# EAGLE design board (EAGLE 7.5.0)
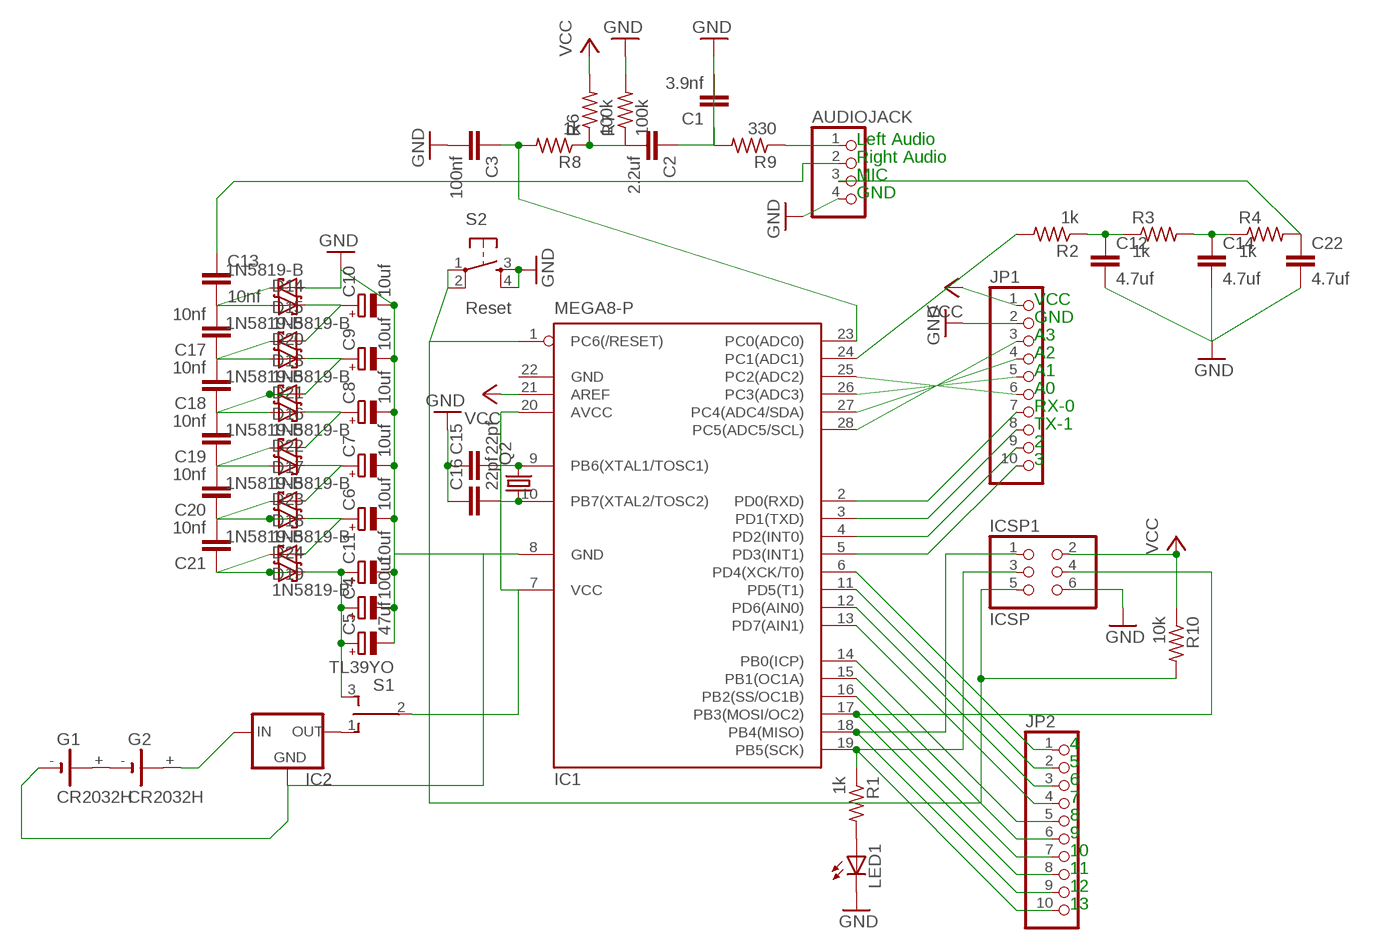
[diagram p0: schematic, sheet 1]

## Parts
AUDIOJACK  PINHD-1X4  [1X04]
C1  3.9nf  C-EU050-024X044  [C050-024X044]
C2  2.2uf  C-EU050-024X044  [C050-024X044]
C3  100nf  C-EU050-024X044  [C050-024X044]
C4  100uf  CPOL-EUE2,5-6E  [E2,5-6E]
C5  47uf  CPOL-EUE2-5  [E2-5]
C6  10uf  CPOL-EUB45181B  [B45181B]
C7  10uf  CPOL-EUB45181B  [B45181B]
C8  10uf  CPOL-EUB45181B  [B45181B]
C9  10uf  CPOL-EUB45181B  [B45181B]
C10  10uf  CPOL-EUB45181B  [B45181B]
C11  10uf  CPOL-EUB45181B  [B45181B]
C12  4.7uf  C-EU050-024X044  [C050-024X044]
C13  10nf  C-EU050-024X044  [C050-024X044]
C14  4.7uf  C-EU050-024X044  [C050-024X044]
C15  22pf  C-EU025-025X050  [C025-025X050]
C16  22pf  C-EU025-025X050  [C025-025X050]
C17  10nf  C-EU050-024X044  [C050-024X044]
C18  10nf  C-EU050-024X044  [C050-024X044]
C19  10nf  C-EU050-024X044  [C050-024X044]
C20  10nf  C-EU050-024X044  [C050-024X044]
C21  10nf  C-EU050-024X044  [C050-024X044]
C22  4.7uf  C-EU050-024X044  [C050-024X044]
D13  1N5819-B  [DO41-7.6]
D14  1N5819-B  [DO41-7.6]
D15  1N5819-B  [DO41-7.6]
D16  1N5819-B  [DO41-7.6]
D17  1N5819-B  [DO41-7.6]
D18  1N5819-B  [DO41-7.6]
D19  1N5819-B  [DO41-7.6]
D20  1N5819-B  [DO41-7.6]
D21  1N5819-B  [DO41-7.6]
D22  1N5819-B  [DO41-7.6]
D23  1N5819-B  [DO41-7.6]
D24  1N5819-B  [DO41-7.6]
G1  CR2032H  [CR2032H]
G2  CR2032H  [CR2032H]
IC1  MEGA8-P  [DIL28-3]
IC2  XC63FPL  [TO92]
ICSP1  ICSP  PINHD-2X3  [2X03]
JP1  PINHD-1X10  [1X10]
JP2  PINHD-1X10  [1X10]
LED1  LED3MM  [LED3MM]
Q2  CRYSTALHC18U-V  [HC18U-V]
R1  1k  R-US_0207/10  [0207/10]
R2  1k  R-US_0207/10  [0207/10]
R3  1k  R-US_0207/10  [0207/10]
R4  1k  R-US_0207/10  [0207/10]
R6  100k  R-US_0207/10  [0207/10]
R7  100k  R-US_0207/10  [0207/10]
R8  1k  R-US_0207/10  [0207/10]
R9  330  R-US_0207/10  [0207/10]
R10  10k  R-US_0207/10  [0207/10]
S1  TL39YO  [TL3XYO]
S2  Reset  TAC_SWITCHPTH  [TACTILE-PTH]

## Nets
GND: AUDIOJACK.4 C1.2 C3.2 C4.- C5.- C6.- C7.- C8.- C9.- C10.- C11.- C12.2 C14.2 C15.1 C16.1 C22.2 D15.A G1.- IC1.8(GND) IC2.2(GND) ICSP1.6 JP1.2 LED1.K(C) R7.2 R9.2 S2.3 S2.4
N$1: IC1.18(PB4(MISO)) ICSP1.1 JP2.9
N$2: AUDIOJACK.2 C13.1
N$3: AUDIOJACK.1 R9.1
N$4: IC1.24(PC1(ADC1)) R2.2
N$5: IC1.19(PB5(SCK)) ICSP1.3 JP2.10 R1.1
N$6: IC1.1(PC6(/RESET)) ICSP1.5 R10.2 S2.1 S2.2
N$7: C15.2 IC1.9(PB6(XTAL1/TOSC1)) Q2.2
N$8: C16.2 IC1.10(PB7(XTAL2/TOSC2)) Q2.1
N$9: IC2.3(OUT) S1.1(O)
N$10: G1.+ G2.-
N$11: G2.+ IC2.1(IN)
N$12: IC1.7(VCC) IC1.20(AVCC) S1.2(P)
N$13: C3.1 IC1.23(PC0(ADC0)) R8.2
N$14: LED1.A R1.2
N$15: C1.1 C2.1
N$16: IC1.28(PC5(ADC5/SCL)) JP1.3
N$17: C12.1 R2.1 R3.1
N$18: C14.1 R3.2 R4.1
N$19: IC1.27(PC4(ADC4/SDA)) JP1.4
N$20: AUDIOJACK.3 C22.1 R4.2
N$21: IC1.26(PC3(ADC3)) JP1.5
N$22: IC1.17(PB3(MOSI/OC2)) ICSP1.4 JP2.8
N$23: IC1.25(PC2(ADC2)) JP1.6
N$24: C2.2 R6.1 R7.1 R8.1
N$25: IC1.2(PD0(RXD)) JP1.7
N$26: IC1.3(PD1(TXD)) JP1.8
N$27: IC1.4(PD2(INT0)) JP1.9
N$28: IC1.5(PD3(INT1)) JP1.10
N$29: IC1.6(PD4(XCK/T0)) JP2.1
N$30: IC1.11(PD5(T1)) JP2.2
N$31: IC1.12(PD6(AIN0)) JP2.3
N$32: IC1.13(PD7(AIN1)) JP2.4
N$33: IC1.14(PB0(ICP)) JP2.5
N$34: IC1.15(PB1(OC1A)) JP2.6
N$35: IC1.16(PB2(SS/OC1B)) JP2.7
N$36: C13.2 C17.2 D14.A D15.C
N$37: C17.1 C18.2 D13.C D20.A
N$38: C18.1 C19.2 D16.C D21.A
N$39: C19.1 C20.2 D17.C D22.A
N$40: C20.1 C21.2 D18.C D23.A
N$41: C21.1 D19.C D24.A
N$42: C10.+ D13.A D14.C
N$43: C9.+ D16.A D20.C
N$44: C8.+ D17.A D21.C
N$45: C7.+ D18.A D22.C
N$46: C6.+ D19.A D23.C
N$47: C4.+ C5.+ C11.+ D24.C S1.3(S)
VCC: IC1.21(AREF) ICSP1.2 JP1.1 R6.2 R10.1
Unconnected: G1.+@1(+) G2.+@1(+)

## Notes on the sheet
- Left Audio
- Right Audio
- MIC
- GND
- VCC
- GND
- A3
- A2
- A1
- A0
- RX-0
- TX-1
- 2
- 3
- 4
- 5
- 6
- 7
- 8
- 9
- 10
- 11
- 12
- 13

## Power pins joined to a net without a drawn wire
GND: IC1.22(GND)

## Library data of the parts
AUDIOJACK = pinhead:PINHD-1X4: PIN HEADER
C1-C3 C12-C22 = resistor:C-EU: CAPACITOR, European symbol
C4-C11 = resistor:CPOL-EU: POLARIZED CAPACITOR, European symbol
D13-D24 = diode:1N581*: 1.0A SCHOTTKY BARRIER RECTIFIER Source: http://www.diodes.com/datasheets/ds23001.pdf
G1 G2 = battery:CR2032H: LI BATTERY Varta
IC1 = atmel:MEGA8-P: MICROCONTROLLER 8 Kbytes FLASH, 1 kbytes SRAM, 512 bytes EEPROM, USART, 4-channel 10 bit ADC, 2-channel 8 bit ADC Pin compatible with Atmega48, ATMega88, ATMega168 Source: avr.lbr; OC_FARNELL: unknown; OC_NEWARK: unknown
IC2 = v-reg:XC63FP: Positiv Voltage Regulators www.torex.co.jp/english/product/pro02/pdf/0201_xc62fp.pdf
ICSP1 = pinhead:PINHD-2X3: PIN HEADER
JP1 JP2 = pinhead:PINHD-1X10: PIN HEADER
LED1 = led:LED: LED OSRAM: - CHIPLED LG R971, LG N971, LY N971, LG Q971, LY Q971, LO R971, LY R971 LH N974, LH R974 LS Q976, LO Q976, LY Q976 LO Q996 - Hyper CHIPLED LW Q18S LB Q993, LB Q99A, LB R99A - SideLED LS A670, LO A670, LY A670, LG A670, LP A670 LB A673, LV A673, LT A673, LW A673 LH A674 LY A675 LS A676, LA A676, LO A676, LY A676, LW A676 LS A679, LY A679, LG A679 - Hyper Micro SIDELED® LS Y876, LA Y876, LO Y876, LY Y876 LT Y87S - SmartLED LW L88C, LW L88S LB L89C, LB L89S, LG L890 LS L89K, LO L89K, LY L89K LS L896, LA L896, LO L896, LY L896 - TOPLED LS T670, LO T670, LY T670, LG T670, LP T670 LSG T670, LSP T670, LSY T670, LOP T670, LYG T670 LG T671, LOG T671, LSG T671 LB T673, LV T673, LT T673, LW T673 LH T674 LS T676, LA T676, LO T676, LY T676, LB T676, LH T676, LSB T676, LW T676 LB T67C, LV T67C, LT T67C, LS T67K, LO T67K, LY T67K, LW E67C LS E67B, LA E67B, LO E67B, LY E67B, LB E67C, LV E67C, LT E67C LW T67C LS T679, LY T679, LG T679 LS T770, LO T770, LY T770, LG T770, LP T770 LB T773, LV T773, LT T773, LW T773 LH T774 LS E675, LA E675, LY E675, LS T675 LS T776, LA T776, LO T776, LY T776, LB T776 LHGB T686 LT T68C, LB T68C - Hyper Mini TOPLED® LB M676 - Mini TOPLED Santana® LG M470 LS M47K, LO M47K, LY M47K Source: http://www.osram.convergy.de LUXEON: - LUMILED® LXK2-PW12-R00, LXK2-PW12-S00, LXK2-PW14-U00, LXK2-PW14-V00 LXK2-PM12-R00, LXK2-PM12-S00, LXK2-PM14-U00 LXK2-PE12-Q00, LXK2-PE12-R00, LXK2-PE12-S00, LXK2-PE14-T00, LXK2-PE14-U00 LXK2-PB12-K00, LXK2-PB12-L00, LXK2-PB12-M00, LXK2-PB14-N00, LXK2-PB14-P00, LXK2-PB14-Q00 LXK2-PR12-L00, LXK2-PR12-M00, LXK2-PR14-Q00, LXK2-PR14-R00 LXK2-PD12-Q00, LXK2-PD12-R00, LXK2-PD12-S00 LXK2-PH12-R00, LXK2-PH12-S00 LXK2-PL12-P00, LXK2-PL12-Q00, LXK2-PL12-R00 Source: www.luxeon.com KINGBRIGHT: KA-3528ASYC Source: www.kingbright.com
Q2 = crystal:CRYSTAL: CRYSTAL; OC_FARNELL: unknown; OC_NEWARK: unknown
R1-R4 R6-R10 = resistor:R-US_: RESISTOR, American symbol
S1 = switch:TL39YO: TINY SWITCH ON OFF ON Source: http://www2.produktinfo.conrad.com/datenblaetter/700000-724999/705152-da-01-de-Subminiaturschalter_TL_36YO.pdf
S2 = SparkFun-Retired:TAC_SWITCH: Momentary Switch Button commonly used for reset or general input. Spark Fun Electronics SKU : COM-00097 SMT- SWCH-08247

## Board
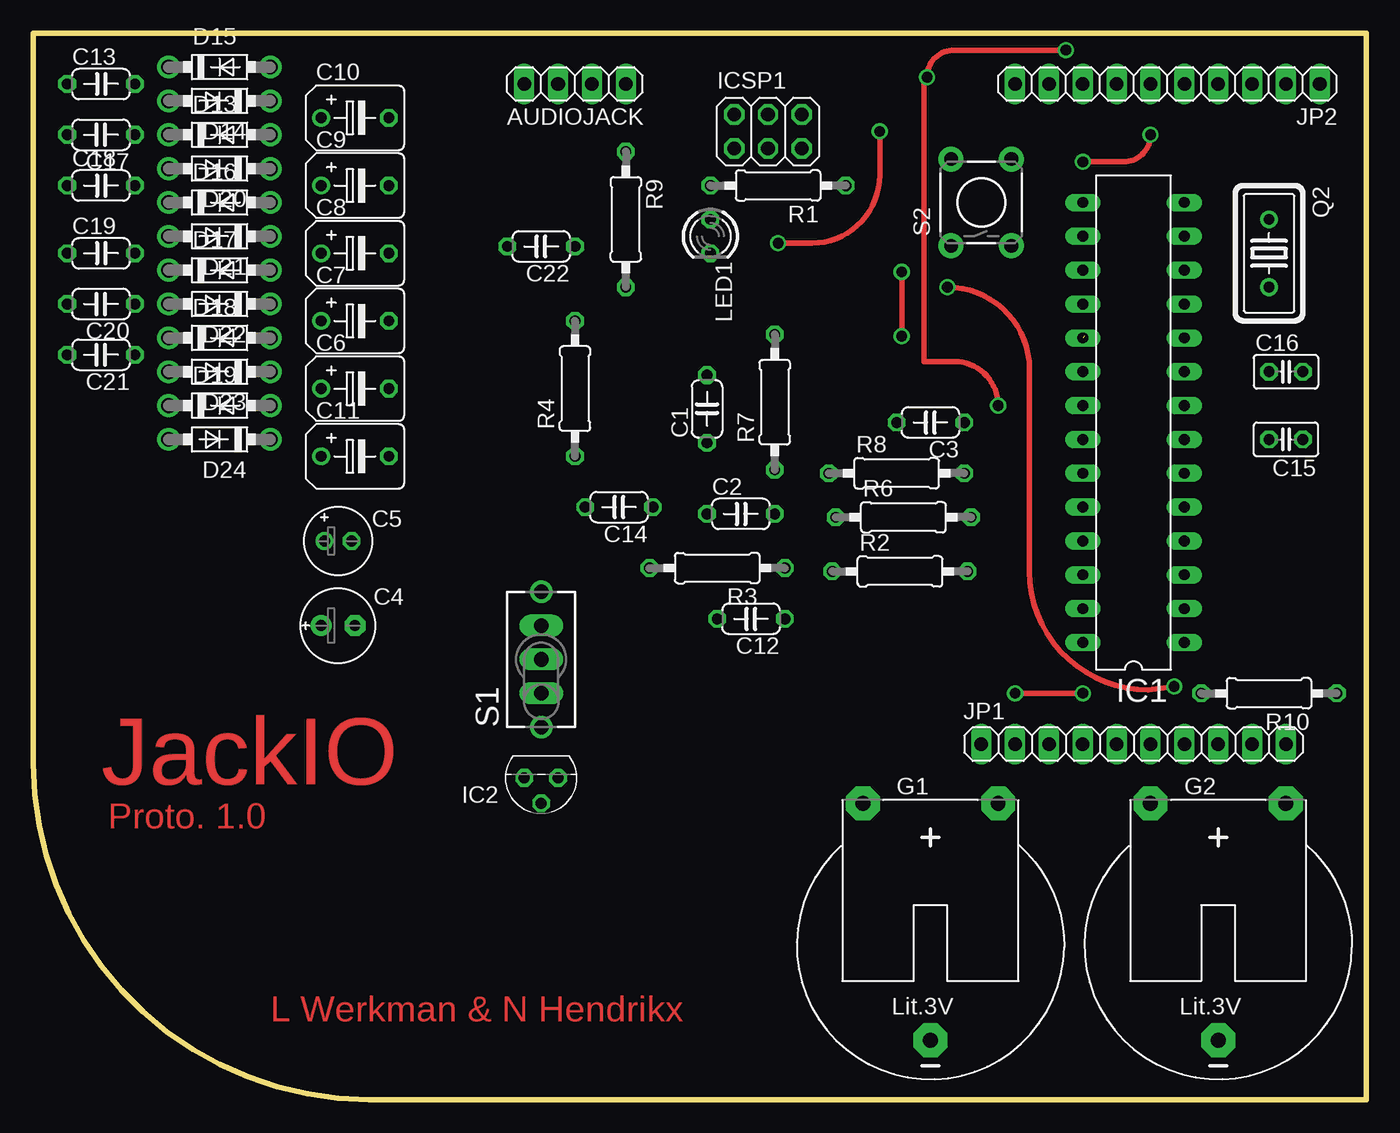
[diagram p1: board, top side]
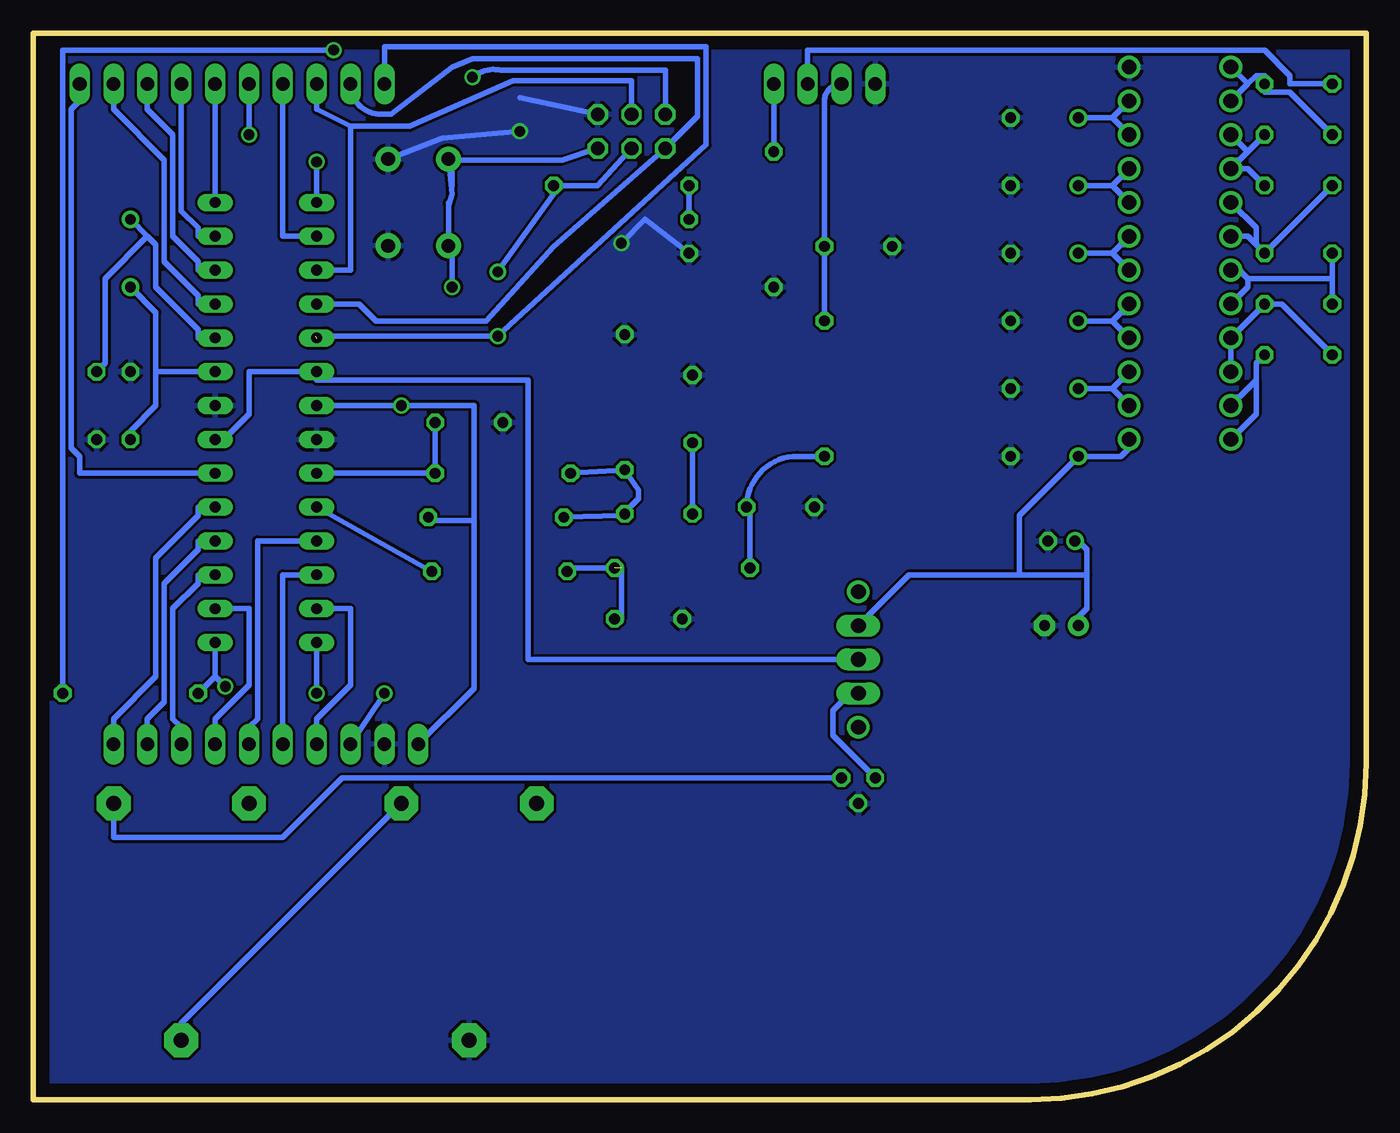
[diagram p2: board, bottom side, seen from below]

Size 100 x 80 mm. Coordinates in mm from the lower left corner, seen from the top.
Outline: 0,80 0,25.21 arc90 25.21,0 100,0 100,80 0,80
Copper layers (1*16): Top 0.035mm / dielectric 1.5mm / Bottom 0.035mm
Design rules "default": minimum track width 10mil, minimum drill 24mil, track to track 8mil, track to pad 8mil, pad to pad 8mil, via to via 8mil, smd to smd 8mil, copper to edge 40mil, drill to drill 8mil, minimum pad ring 10mil, minimum via ring 8mil, stop-mask expansion 4mil, vias tented up to drill 0mil, thermal gap 10mil

### Footprints (pad centres in the part's own frame; a part is rotated, then mirrored left to right if it is on the bottom)
1X04 = drill 1.016 long: 1 -3.81,0; 2 -1.27,0; 3 1.27,0; 4 3.81,0
C050-024X044 = drill 0.813 octagon: 1 -2.54,0; 2 2.54,0
E2,5-6E = drill 0.813 pad 1.575: + -1.27,0 | drill 0.813 pad 1.575 octagon: - 1.27,0
E2-5 = drill 0.813 pad 1.27: + -1.016,0 | drill 0.813 pad 1.27 octagon: - 1.016,0
B45181B = drill 0.813: + -2.54,0 | drill 0.813 octagon: - 2.54,0
C025-025X050 = drill 0.813 octagon: 1 -1.27,0; 2 1.27,0
DO41-7.6 = drill 1.1 pad 1.7: A 3.81,0; C -3.81,0
CR2032H = drill 1.118 pad 2.54 octagon: + 5.08,10.795; +@1 -5.08,10.795; - 0,-6.985
DIL28-3 = drill 0.813 long: 1 -16.51,-3.81; 2 -13.97,-3.81; 3 -11.43,-3.81; 4 -8.89,-3.81; 5 -6.35,-3.81; 6 -3.81,-3.81; 7 -1.27,-3.81; 8 1.27,-3.81; 9 3.81,-3.81; 10 6.35,-3.81; 11 8.89,-3.81; 12 11.43,-3.81; 13 13.97,-3.81; 14 16.51,-3.81; 15 16.51,3.81; 16 13.97,3.81; 17 11.43,3.81; 18 8.89,3.81; 19 6.35,3.81; 20 3.81,3.81; 21 1.27,3.81; 22 -1.27,3.81; 23 -3.81,3.81; 24 -6.35,3.81; 25 -8.89,3.81; 26 -11.43,3.81; 27 -13.97,3.81; 28 -16.51,3.81
TO92 = drill 0.813 octagon: 1 -1.27,0; 2 0,1.905; 3 1.27,0
2X03 = drill 1.016 octagon: 1 -2.54,-1.27; 2 -2.54,1.27; 3 0,-1.27; 4 0,1.27; 5 2.54,-1.27; 6 2.54,1.27
1X10 = drill 1.016 long: 1 -11.43,0; 2 -8.89,0; 3 -6.35,0; 4 -3.81,0; 5 -1.27,0; 6 1.27,0; 7 3.81,0; 8 6.35,0; 9 8.89,0; 10 11.43,0
LED3MM = drill 0.813 octagon: A -1.27,0; K 1.27,0
HC18U-V = drill 0.813: 1 -2.54,0; 2 2.54,0
0207/10 = drill 0.813 octagon: 1 -5.08,0; 2 5.08,0
TL3XYO = drill 1.1 pad 1.422 long: 1 -2.54,0; 2 0,0; 3 2.54,0 | drill 1.1 pad 1.676: M1 -5.08,0; M2 5.08,0
TACTILE-PTH = drill 1.016 pad 1.88: 1 -3.251,2.261; 2 3.251,2.261; 3 -3.251,-2.261; 4 3.251,-2.261

### Placement (x,y rotation side)
AUDIOJACK  40.64,76.2 180 top
C1  50.55,51.82 90 top
C2  53.09,43.94 0 top
C3  67.31,50.8 180 top
C4  22.86,35.56 0 top
C5  22.86,41.91 0 top
C6  24.13,53.34 0 top
C7  24.13,58.42 0 top
C8  24.13,63.5 0 top
C9  24.13,68.58 0 top
C10  24.13,73.66 0 top
C11  24.13,48.26 0 top
C12  53.85,36.07 180 top
C13  5.08,76.2 0 top
C14  43.94,44.45 180 top
C15  93.98,49.53 180 top
C16  93.98,54.61 0 top
C17  5.08,72.39 180 top
C18  5.08,68.58 0 top
C19  5.08,63.5 0 top
C20  5.08,59.69 180 top
C21  5.08,55.88 180 top
C22  38.1,64.01 180 top
D13  13.97,72.39 0 top
D14  13.97,74.93 180 top
D15  13.97,77.47 0 top
D16  13.97,67.31 0 top
D17  13.97,62.23 0 top
D18  13.97,57.15 0 top
D19  13.97,52.07 0 top
D20  13.97,69.85 180 top
D21  13.97,64.77 180 top
D22  13.97,59.69 180 top
D23  13.97,54.61 180 top
D24  13.97,49.53 180 top
G1  67.31,11.43 0 top
G2  88.9,11.43 0 top
IC1  82.55,50.8 90 top
IC2  38.1,24.13 180 top
ICSP1  55.12,72.64 0 top
JP1  82.55,26.67 0 top
JP2  85.09,76.2 180 top
LED1  50.8,64.77 270 top
Q2  92.71,63.5 270 top
R1  55.88,68.58 180 top
R2  65.02,39.62 0 top
R3  51.31,39.88 180 top
R4  40.64,53.34 90 top
R6  65.28,43.69 0 top
R7  55.63,52.32 90 top
R8  64.77,46.99 0 top
R9  44.45,66.04 270 top
R10  92.71,30.48 180 top
S1  38.1,33.02 90 top
S2  71.12,67.31 90 top

### Tracks (layer width: path | path; a pad name or v marks a point on that pad's centre or on a via)
GND  (via drill 0.8)
  Top 0.406: v55.88,64.26 58.42,64.26 arc90 63.5,69.34 v63.5,72.64
  Bottom 0.406: LED1.K 54.1,66.04 v55.88,64.26 | 63.5,75.18 ICSP1.6 | S2.4 69.34,72.14 v63.5,72.64
  pour Bottom: 0,80.01 100.33,80.01 100.33,0 26.43,0 arc-90 0,26.43
N$1
  Bottom 0.406: IC1.18 75.56,59.69 74.3,58.42 66.04,58.42 60.96,64.01 ICSP1.1 50.16,73.79 50.16,78.11 67.06,78.11 68.58,77.47 73.15,73.91 73.91,73.91 arc90 JP2.9
N$2
  Bottom 0.406: C13.1 5.71,76.2 5.71,76.83 7.62,78.74 41.91,78.74 AUDIOJACK.2
N$3
  Bottom 0.406: AUDIOJACK.1 R9.1
N$4
  Bottom 0.406: R2.2 IC1.24
N$5  (via drill 0.8)  (1 unrouted)
  Top 0.406: v65.15,62.1 v65.15,57.28
  Bottom 0.406: ICSP1.3 57.66,68.58 R1.1 60.96,67.94 v65.15,62.1 | 78.87,57.28 v65.15,57.28 49.53,71.63 49.53,78.99 73.66,78.99 JP2.10
N$6  (via drill 0.8)
  Top 0.406: v85.6,30.99 83.64,30.73 arc-90 74.74,39.63 74.74,54.8 arc90 v68.58,60.96
  Bottom 0.406: ICSP1.5 60.33,70.48 68.58,70.48 68.58,68.58 S2.2 68.58,67.94 68.83,67.06 68.86,67.31 S2.1 68.58,64.06 v68.58,60.96 | 86.36,31.75 R10.2 | IC1.1 86.36,31.75 | v85.6,30.99 86.36,31.75
N$7
  Bottom 0.406: 90.81,54.61 IC1.9 | 90.81,54.61 90.81,52.07 92.71,50.16 C15.2 | Q2.2 90.81,59.05 90.81,54.61
N$8
  Bottom 0.406: IC1.10 87.63,57.15 87.63,57.78 90.81,60.96 90.81,64.14 91.44,64.77 | Q2.1 91.44,64.77 | C16.2 94.61,55.24 94.61,61.59 91.44,64.77
N$9
  Bottom 0.406: IC2.3 40.01,27.3 40.01,29.21 38.73,30.48 S1.1
N$10
  Bottom 0.406: G1.+ 88.9,5.71 G2.-
N$11
  Bottom 0.406: IC2.1 76.83,24.13 81.28,19.68 93.98,19.68 G2.+
N$12
  Bottom 0.406: IC1.7 85.72,49.53 83.82,51.44 83.82,54.61 IC1.20 78.74,53.98 62.87,53.98 62.87,33.02 S1.2
N$13
  Bottom 0.406: C3.1 R8.2 IC1.23
N$14
  Bottom 0.406: LED1.A R1.2
N$15
  Bottom 0.406: C2.1 C1.1
N$16  (via drill 0.8)
  Top 0.406: v73.66,30.48 v78.74,30.48
  Bottom 0.406: IC1.28 v78.74,30.48 | JP1.3 v73.66,30.48
N$17  (1 unrouted)
  Bottom 0.406: R2.1 59.94,39.88 55.88,39.88 55.88,36.07 C12.1
N$18
  Bottom 0.406: R3.2 46.23,44.45 C14.1 arc90 42.67,48.26 R4.1
N$19
  Bottom 0.406: IC1.27 76.2,36.83 76.2,31.11 78.74,28.57 JP1.4
N$20
  Bottom 0.406: R4.2 C22.1 40.64,74.93 arc90 AUDIOJACK.3
N$21
  Bottom 0.406: IC1.26 81.28,39.37 JP1.5
N$22
  Bottom 0.406: IC1.17 76.2,62.23 76.2,73.03 | 76.2,73.03 78.74,74.3 JP2.8 | ICSP1.4 55.12,76.45 64.01,76.45 71.75,73.03 76.2,73.03
N$23
  Bottom 0.406: IC1.25 83.19,41.91 83.19,28.57 83.82,27.94 JP1.6
N$24
  Bottom 0.406: 55.88,43.81 R6.1 | 55.88,43.81 54.61,45.09 54.61,45.72 R7.1 R8.1 | 55.88,43.81 C2.2
N$25
  Bottom 0.406: IC1.2 83.82,36.83 83.82,31.11 86.36,28.57 JP1.7
N$26
  Bottom 0.406: IC1.3 87.63,39.37 87.63,38.73 89.53,36.83 89.53,28.57 88.9,27.94 JP1.8
N$27
  Bottom 0.406: IC1.4 87.63,41.91 87.63,41.27 90.17,38.73 90.17,29.84 91.44,28.57 JP1.9
N$28
  Bottom 0.406: IC1.5 87.63,44.45 87.63,43.81 90.81,40.64 90.81,31.75 93.98,28.57 JP1.10
N$29
  Bottom 0.406: IC1.6 96.52,46.99 96.52,48.26 97.16,48.9 97.16,74.3 96.52,74.93 JP2.1
N$30
  Bottom 0.406: IC1.11 87.63,59.69 87.63,60.33 90.17,62.87 90.17,70.48 93.98,74.3 JP2.2
N$31
  Bottom 0.406: IC1.12 87.63,62.23 87.63,62.87 89.53,64.77 89.53,72.39 91.44,74.3 JP2.3
N$32
  Bottom 0.406: IC1.13 87.63,64.77 87.63,65.41 88.9,66.67 JP2.4
N$33
  Bottom 0.406: JP2.5 IC1.14
N$34  (via drill 0.8)
  Top 0.406: v78.74,70.36 81.79,70.36 arc90 v83.82,72.39
  Bottom 0.406: IC1.15 v78.74,70.36 | v83.82,72.39 JP2.6
N$35
  Bottom 0.406: IC1.16 81.28,64.77 JP2.7
N$36
  Bottom 0.406: C17.2 5.71,75.56 7.62,75.56 C13.2 7.62,76.83 8.26,76.83 8.89,76.2 | 8.89,76.2 D14.A | 8.89,76.2 D15.C
N$37
  Bottom 0.406: C18.2 8.89,69.85 D20.A 10.16,70.48 9.53,70.48 8.89,71.12 | 8.89,71.12 C17.1 | 8.89,71.12 D13.C
N$38
  Bottom 0.406: 8.26,64.14 8.89,64.77 D21.A | 8.26,64.14 C19.2 C18.1 | D16.C 8.26,65.41 8.26,64.14
N$39
  Bottom 0.406: C19.1 2.54,61.59 | 2.54,61.59 C20.2 | D22.A 8.89,60.96 8.89,61.59 | 8.89,61.59 9.53,62.23 D17.C | 8.89,61.59 2.54,61.59
N$40
  Bottom 0.406: C21.2 6.35,59.69 C20.1 D18.C D23.A
N$41
  Bottom 0.406: C21.1 8.26,55.24 8.26,53.98 | 8.26,53.98 9.53,52.7 10.16,52.7 D19.C | D24.A 8.26,51.44 8.26,53.98
N$42
  Bottom 0.406: 19.05,73.66 C10.+ | 19.05,73.66 18.41,74.3 17.78,74.3 D14.C | 19.05,73.66 D13.A
N$43
  Bottom 0.406: 19.05,68.58 C9.+ | 19.05,68.58 18.41,69.22 17.78,69.22 D20.C | 19.05,68.58 D16.A
N$44
  Bottom 0.406: 19.05,63.5 C8.+ | 19.05,63.5 18.41,64.14 17.78,64.14 D21.C | 19.05,63.5 D17.A
N$45
  Bottom 0.406: 19.05,58.42 C7.+ | 19.05,58.42 18.41,59.05 17.78,59.05 D22.C | 19.05,58.42 D18.A
N$46
  Bottom 0.406: 19.05,53.34 C6.+ | 19.05,53.34 18.41,53.98 17.78,53.98 D23.C | 19.05,53.34 D19.A
N$47
  Bottom 0.406: D24.C 17.78,48.9 18.41,48.26 C11.+ 26.04,43.81 26.04,39.37 | 20.95,39.37 20.95,36.83 21.59,36.2 C4.+ | 20.95,39.37 20.95,41.27 21.59,41.91 C5.+ | S1.3 34.29,39.37 26.04,39.37 | 20.95,39.37 26.04,39.37
VCC  (via drill 0.8)
  Top 0.406: v77.47,78.74 69.09,78.74 arc90 v67.06,76.71 arc90 66.8,76.45 66.8,55.37 69.09,55.37 arc-90 v72.39,52.07
  Bottom 0.406: 66.93,43.43 66.93,52.07 v72.39,52.07 IC1.21 79.38,52.07 | ICSP1.2 52.58,77.22 64.9,77.22 arc-55 v67.06,76.71 | v77.47,78.74 97.79,78.74 R10.1 | R6.2 arc-90 70.1,43.43 66.93,43.43 | 66.93,43.43 66.93,30.86 JP1.1

### Text on the board
Top: JackIO | Proto. 1.0 | L Werkman & N Hendrikx